# EAGLE design amc6821-breakout-v3.0 (EAGLE 9.6.2)
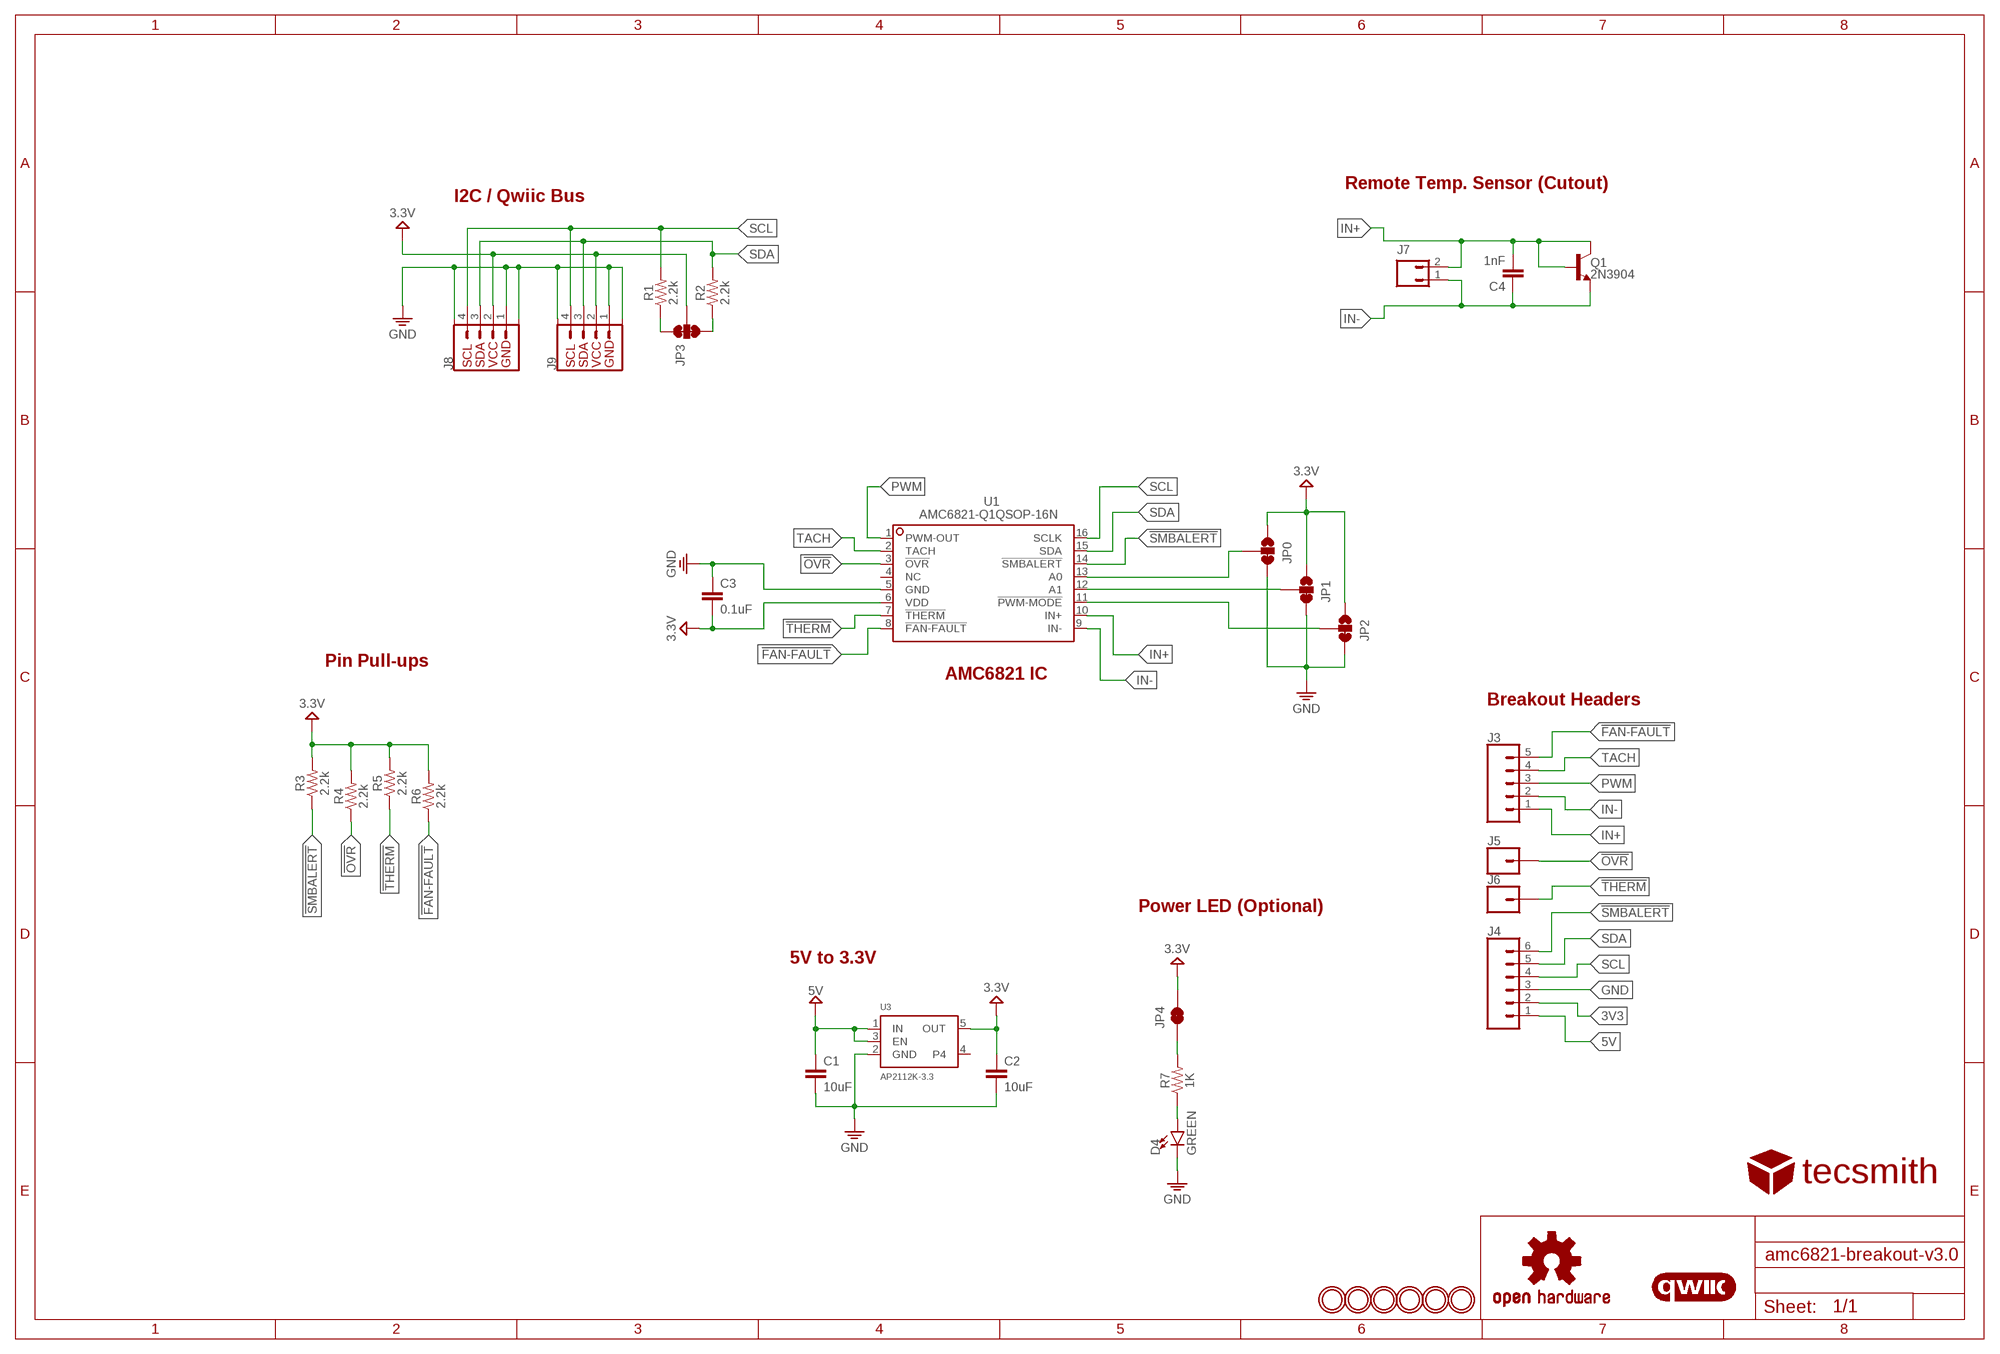
[diagram p0: schematic, sheet 1]

## Parts
C1  10uF  10UF-0603-6.3V-20%  [0603]
C2  10uF  10UF-0603-6.3V-20%  [0603]
C3  0.1uF  0.1UF-0603-25V-5%  [0603]
C4  1nF  1.0NF/1000PF-0603-50V-10%  [0603]
D4  GREEN  LED-GREEN0603  [LED-0603]
J3  CONN_05  [1X05]
J4  CONN_06SILK_FEMALE_PTH  [1X06]
J5  CONN_01  [1X01]
J6  CONN_01  [1X01]
J7  CONN_02  [1X02-LONG]
J8  QWIIC_RIGHT_ANGLE  QWIIC_CONNECTOR_GNDJS-1MM  [JST04_1MM_RA]
J9  QWIIC_RIGHT_ANGLE  QWIIC_CONNECTOR_GNDJS-1MM  [JST04_1MM_RA]
JP0  JUMPER-SMT_3_1-NC_TRACE_SILK  [SMT-JUMPER_3_1-NC_TRACE_SILK]
JP1  JUMPER-SMT_3_1-NC_TRACE_SILK  [SMT-JUMPER_3_1-NC_TRACE_SILK]
JP2  JUMPER-SMT_3_1-NC_TRACE_SILK  [SMT-JUMPER_3_1-NC_TRACE_SILK]
JP3  JUMPER-SMT_3_2-NC_TRACE_SILK  [SMT-JUMPER_3_2-NC_TRACE_SILK]
JP4  JUMPER-SMT_2_NC_TRACE_SILK  [SMT-JUMPER_2_NC_TRACE_SILK]
LOGO1  OSHW-LOGOS  [OSHW-LOGO-S]
LOGO2  QWIIC_LOGO_6MM  [QWIIC_6MM]
Q1  2N3904  TRANS_NPN-MMBTA42  [SOT23-3]
R1  2.2k  2.2KOHM-0603-1/10W-1%  [0603]
R2  2.2k  2.2KOHM-0603-1/10W-1%  [0603]
R3  2.2k  2.2KOHM-0603-1/10W-1%  [0603]
R4  2.2k  2.2KOHM-0603-1/10W-1%  [0603]
R5  2.2k  2.2KOHM-0603-1/10W-1%  [0603]
R6  2.2k  2.2KOHM-0603-1/10W-1%  [0603]
R7  1K  RESISTOR0805  [0805]
U1  AMC6821-Q1QSOP-16N  [QSOP-16N]
U3  AP2112K-3.3  VREG_SOT23-5  [SOT23-5]
U$1  TECSMITH-LOGO  [TECSMITH-LOGO]
U$4  MOUNTINGHOLE2.5  [MOUNTINGHOLE_2.5_PLATED]
U$5  MOUNTINGHOLE2.5  [MOUNTINGHOLE_2.5_PLATED]
U$7  MOUNTINGHOLE2.5  [MOUNTINGHOLE_2.5_PLATED]
U$8  MOUNTINGHOLE2.5  [MOUNTINGHOLE_2.5_PLATED]
U$9  MOUNTINGHOLE2.5  [MOUNTINGHOLE_2.5_PLATED]
U$10  MOUNTINGHOLE2.5  [MOUNTINGHOLE_2.5_PLATED]

## Nets
3V3: C2.1 C3.2 J4.2 J8.2 J9.2 JP0.1 JP1.1 JP2.1 JP3.2 JP4.2 R3.2 R4.2 R5.2 R6.2 U1.6(VDD) U3.5(OUT) ; supply symbol labelled 3.3V
5V: C1.1 J4.1 U3.1(IN) U3.3(EN)
!FAN-FAULT: J3.5 R6.1 U1.8(!FAN-FAULT)
!OVR: J5.1 R4.1 U1.3(!OVR)
!SMBALERT: J4.6 R3.1 U1.14(!SMBALERT)
!THERM: J6.1 R5.1 U1.7(!THERM)
GND: C1.2 C2.2 C3.1 D4.C J4.3 J8.1 J8.NC1 J8.NC2 J9.1 J9.NC1 J9.NC2 JP0.3 JP1.3 JP2.3 U1.5(GND) U3.2(GND)
IN+: C4.2 J3.1 J7.2 Q1.1(B) Q1.3(C) U1.10(IN+)
IN-: C4.1 J3.2 J7.1 Q1.2(E) U1.9(IN-)
N$1: JP0.2 U1.13(A0)
N$3: JP3.3 R2.1
N$4: JP3.1 R1.1
N$5: JP2.2 U1.11(!PWM-MODE)
N$6: JP1.2 U1.12(A1)
N$8: D4.A R7.1
N$12: JP4.1 R7.2
PWM: J3.3 U1.1(PWM-OUT)
SCL: J4.4 J8.4 J9.4 R1.2 U1.16(SCLK)
SDA: J4.5 J8.3 J9.3 R2.2 U1.15(SDA)
TACH: J3.4 U1.2(TACH)
Unconnected: U1.4(NC) U3.4

## Notes on the sheet
- Remote Temp. Sensor (Cutout)
- I2C / Qwiic Bus
- Pin Pull-ups
- AMC6821 IC
- Breakout Headers
- Power LED (Optional)
- 5V to 3.3V

## Library data of the parts
C1 C2 = SparkFun-Capacitors:10UF: 10.0µF ceramic capacitors A capacitor is a passive two-terminal electrical component used to store electrical energy temporarily in an electric field.; PROD_ID: CAP-11015
C3 = SparkFun-Capacitors:0.1UF: 0.1µF ceramic capacitors A capacitor is a passive two-terminal electrical component used to store electrical energy temporarily in an electric field.; PROD_ID: CAP-08604
C4 = SparkFun-Capacitors:1.0NF/1000PF: 1nF/1,000pF ceramic capacitors A capacitor is a passive two-terminal electrical component used to store electrical energy temporarily in an electric field.; PROD_ID: CAP-07886
D4 = SparkFun-LED:LED-GREEN: Green SMD LED Used in manufacturing of various products at SparkFun Packages: 0603 - SMD 0603 package [Product Link] <http://www.futureelectronics.com/en/technologies/semiconductors/optoelectronics/leds/Pages/9894312-LTST-C190GKT.aspx?CrossPart=HSMG-C190&IM=0> LilyPad 1206 - SMD1206 LilyPad package [Product Link] <http://www.futureelectronics.com/en/Technologies/Product.aspx?ProductID=IN150NGHARVATEKCORPORATION2049943&IM=0> 1206 - SMD1206 package [Product Link] <http://www.futureelectronics.com/en/technologies/semiconductors/optoelectronics/leds/Pages/8315665-LTST-C150KGKT.aspx?IM=0> 1206 Bottom Mount -SMD 1206 Bottom Mount [Product Link] <http://www.digikey.com/product-detail/en/lite-on-inc/LTST-C230KGKT/160-1456-1-ND/386854> SparkFun Products: Pro Mini 328 -5V <https://www.sparkfun.com/products/821> RedBoard <https://www.sparkfun.com/products/12757> MP3 Trigger <https://www.sparkfun.com/products/13720> Makey Makey <https://www.sparkfun.com/products/11076>; PROD_ID: DIO-00821
J3 = SparkFun-Connectors:CONN_05: Multi connection point. Often used as Generic Header-pin footprint for 0.1 inch spaced/style header connections On any of the 0.1 inch spaced packages, you can populate with these: Break Away Headers - Straight <https://www.sparkfun.com/products/116> (PRT-00116) Break Away Male Headers - Right Angle <https://www.sparkfun.com/products/553> (PRT-00553) Female Headers <https://www.sparkfun.com/products/115> (PRT-00115) Break Away Headers - Machine Pin <https://www.sparkfun.com/products/117> (PRT-00117) Break Away Female Headers - Swiss Machine Pin <https://www.sparkfun.com/products/743> (PRT-00743) For SCREWTERMINALS and SPRING TERMINALS visit here: Screw Terimnals on SparkFun.com <https://www.sparkfun.com/search/results?term=Screw+Terminals> (5mm/3.5mm/2.54mm spacing) This device is also useful as a general connection point to wire up your design to another part of your project. Our various solder wires solder well into these plated through hole pads. Hook-Up Wire - Assortment (Stranded, 22 AWG) <https://www.sparkfun.com/products/11375> (PRT-11375) Hook-Up Wire - Assortment (Solid Core, 22 AWG) <https://www.sparkfun.com/products/11367> (PRT-11367) View the entire wire category on our website here <https://www.sparkfun.com/categories/141> Special notes: Molex polarized connector foot print use with SKU : PRT-08231 with associated crimp pins and housings. 1MM SMD Version SKU: PRT-10208
J4 = SparkFun-Connectors:CONN_06: Multi connection point. Often used as Generic Header-pin footprint for 0.1 inch spaced/style header connections On any of the 0.1 inch spaced packages, you can populate with these: Break Away Headers - Straight <https://www.sparkfun.com/products/116> (PRT-00116) Break Away Male Headers - Right Angle <https://www.sparkfun.com/products/553> (PRT-00553) Female Headers <https://www.sparkfun.com/products/115> (PRT-00115) Break Away Headers - Machine Pin <https://www.sparkfun.com/products/117> (PRT-00117) Break Away Female Headers - Swiss Machine Pin <https://www.sparkfun.com/products/743> (PRT-00743) Arduino Stackable Header - 6 Pin <https://www.sparkfun.com/products/9280> (PRT-09280) For SCREWTERMINALS and SPRING TERMINALS visit here: Screw Terimnals on SparkFun.com <https://www.sparkfun.com/search/results?term=Screw+Terminals> (5mm/3.5mm/2.54mm spacing) This device is also useful as a general connection point to wire up your design to another part of your project. Our various solder wires solder well into these plated through hole pads. Hook-Up Wire - Assortment (Stranded, 22 AWG) <https://www.sparkfun.com/products/11375> (PRT-11375) Hook-Up Wire - Assortment (Solid Core, 22 AWG) <https://www.sparkfun.com/products/11367> (PRT-11367) View the entire wire category on our website here <https://www.sparkfun.com/categories/141>; PROD_ID: CONN-08437
J5 J6 = SparkFun-Connectors:CONN_01: Single connection point. Often used as Generic Header-pin footprint for 0.1 inch spaced/style header connections On any of the 0.1 inch spaced packages, you can populate with these: Break Away Headers - Straight <https://www.sparkfun.com/products/116> (PRT-00116) Break Away Male Headers - Right Angle <https://www.sparkfun.com/products/553> (PRT-00553) Female Headers <https://www.sparkfun.com/products/115> (PRT-00115) Break Away Headers - Machine Pin <https://www.sparkfun.com/products/117> (PRT-00117) Break Away Female Headers - Swiss Machine Pin <https://www.sparkfun.com/products/743> (PRT-00743) This device is also useful as a general connection point to wire up your design to another part of your project. Our various solder wires solder well into these plated through hole pads. Hook-Up Wire - Assortment (Stranded, 22 AWG) <https://www.sparkfun.com/products/11375> (PRT-11375) Hook-Up Wire - Assortment (Solid Core, 22 AWG) <https://www.sparkfun.com/products/11367> (PRT-11367) View the entire wire category on our website here <https://www.sparkfun.com/categories/141> Special notes: SMTSO-256-ET is a "flush mount" nut for a 4-40 screw. We mostly use this on specialty testbeds; it is a nice way to connect hardware to your PCB at an adjustable hieght. Also note, the SNAP packages are for using a snappable style connector. We sell a baggie of snaps and they are also used on two LilyPad designs: Snap Assortment - 30 pack (male and female) <https://www.sparkfun.com/products/11347> (DEV-11347) LilyPad Arduino SimpleSnap <https://www.sparkfun.com/products/10941> (DEV-10941) LilyPad SimpleSnap Protoboard <https://www.sparkfun.com/products/10940> (DEV-10940)
J7 = VinoRodrigues_Custom_Eagle:CONN_02: Multi connection point. Often used as Generic Header-pin footprint for 0.1 inch spaced/style header connections On any of the 0.1 inch spaced packages, you can populate with these: Break Away Headers - Straight <https://www.sparkfun.com/products/116> (PRT-00116) Break Away Male Headers - Right Angle <https://www.sparkfun.com/products/553> (PRT-00553) Female Headers <https://www.sparkfun.com/products/115> (PRT-00115) Break Away Headers - Machine Pin <https://www.sparkfun.com/products/117> (PRT-00117) Break Away Female Headers - Swiss Machine Pin <https://www.sparkfun.com/products/743> (PRT-00743) For SCREWTERMINALS and SPRING TERMINALS visit here: Screw Terimnals on SparkFun.com <https://www.sparkfun.com/search/results?term=Screw+Terminals> (5mm/3.5mm/2.54mm spacing) This device is also useful as a general connection point to wire up your design to another part of your project. Our various solder wires solder well into these plated through hole pads. Hook-Up Wire - Assortment (Stranded, 22 AWG) <https://www.sparkfun.com/products/11375> (PRT-11375) Hook-Up Wire - Assortment (Solid Core, 22 AWG) <https://www.sparkfun.com/products/11367> (PRT-11367) View the entire wire category on our website here <https://www.sparkfun.com/categories/141> Special notes: Molex polarized connector foot print use with: PRT-08233 with associated crimp pins and housings. 2.54_SCREWTERM for use with PRT-10571. 3.5mm Screw Terminal footprints for PRT-08084 5mm Screw Terminal footprints for use with PRT-08432
J8 J9 = VinoRodrigues_Custom_Eagle:QWIIC_CONNECTOR_GND: SparkFun I2C Standard Qwiic Connector An SMD 1mm pitch JST connector makes it easy and quick (get it? Qwiic?) to connect I2C devices to each other. The Qwiic system <http://www.sparkfun.com/qwiic> enables fast and solderless connection between popular platforms and various sensors and actuators. We carry 200mm <https://www.sparkfun.com/products/14204>, 100mm <https://www.sparkfun.com/products/14205>, 50mm <https://www.sparkfun.com/products/14206>, and breadboard friendly <https://www.sparkfun.com/products/14207> Qwiic cables. We also offer 10 pcs strips <https://www.sparkfun.com/products/14323> the SMD connectors.; PROD_ID: CONN-13694
JP0 JP1 JP2 = SparkFun-Jumpers:JUMPER-SMT_3_1-NC_TRACE: Normally closed trace jumper (1 of 2 connections) This jumper has a trace between two pads so it's normally closed (NC). The other connection is normally open (NO). Use a razor knife to open the connection. For best results follow the IPC guidelines for cutting traces: Cutout at least 0.063 mm (0.005 in). Remove all loose material to clean up the cut area. Seal the cut with an approved epoxy. Reapply solder to reclose the connection, or to close the NO connection.
JP3 = SparkFun-Jumpers:JUMPER-SMT_3_2-NC_TRACE: Normally closed trace jumper (2 of 2 connections) This jumper has a trace between all three pads so they are normally closed (NC). Use a razor knife to open the connection(s). For best results follow the IPC guidelines for cutting traces: Cutout at least 0.063 mm (0.005 in). Remove all loose material to clean up the cut area. Seal the cut with an approved epoxy. Reapply solder to reclose the connection(s).
JP4 = SparkFun-Jumpers:JUMPER-SMT_2_NC_TRACE: Normally closed trace jumper This jumper has a trace between two pads so it's normally closed (NC). Use a razor knife to open the connection. For best results follow the IPC guidelines for cutting traces: Cutout at least 0.063 mm (0.005 in). Remove all loose material to clean up the cut area. Seal the cut with an approved epoxy. Reapply solder to reclose the connection.
LOGO1 = SparkFun-Aesthetics:OSHW-LOGO: Open-Source Hardware (OSHW) Logo This logo indicates the piece of hardware it is found on incorporates a OSHW license and/or adheres to the definition of open source hardware found here: http://freedomdefined.org/OSHW
LOGO2 = SparkFun-Aesthetics:QWIIC_LOGO: Qwiic Logos for placement on schematic and PCB. The 5.5mm silk logo is best for placing next to Qwiic connector.
Q1 = SparkFun-DiscreteSemi:TRANS_NPN: NPN transistor Current controlled devices typically used to amplify current or used as a switch. BC547 - COM-08928 <http://www.sparkfun.com/products/8928> (TO-92 45V 100mA) (1.Collector 2.Base 3.Emitter) 2N3904 - COM-00521 <http://www.sparkfun.com/products/521> (TO-92 40V 200mA) (1.Emitter 2.Base 3.Collector) P2N2222A - COM-12852 <http://www.sparkfun.com/products/12852> (TO-92 40V 600mA) (1.Collector 2.Base 3.Emitter); PROD_ID: TRANS-09116; VALUE: 500mA/300V
R1-R6 = SparkFun-Resistors:2.2KOHM: 2.2kΩ resistor A resistor is a passive two-terminal electrical component that implements electrical resistance as a circuit element. Resistors act to reduce current flow, and, at the same time, act to lower voltage levels within circuits. - Wikipedia; PROD_ID: RES-08272
R7 = SparkFun-Resistors:RESISTOR: Generic Resistor Package
U1 = VinoRodrigues_Custom_Eagle:AMC6821-Q1: AMC6821 www.ti.com/product/AMC6821
U3 = microbuilder:VREG_SOT23-5: SOT23-5 Fixed Voltage Regulators Part Current Out V Out V In V Dropout θJA (°C/W) TJ (°C) Digikey Part No. ADP121 150mA 3.3V 3.4-5.5V 0.09V @ 150mA -- -- ADP121-AUJZ33R7CT-ND ADP121 150mA 3.0V 3.1-5.5V 0.09V @ 150mA -- -- ADP121-AUJZ30R7CT-ND ADP122 300mA 3.3V 3.4-5.5V 0.085V @ 300mA -- -- ADP122AUJZ-3.3-R7CT-ND ADP1712 300mA 3.3V 3.5-5.5V 0.17V @ 300mA -- -- ADP1712AUJZ-3.3-R7TR-ND AP7311 (Low Cost) 150mA 3.3V 3.5-6V 0.15V @ 150mA -- -- AP7311-33WG-7DICT-ND LD39015M18R 150mA 1.8V 1.9V-5.5V 0.08V @ 100mA -- -- 497-6977-1-ND LP2985A-33DBVR 150mA 3.3V 3.3-16V 0.28V @ 150mA 206 150 296-18479-1-ND MCP1824T-3302E/OT 300mA 3.3V 3.5V-6V 0.2V @ 300mA -- -- MCP1824T-3302E/OTCT-ND MIC5205-2.5YM5 TR 150mA 2.5V 2.7-16V 0.165V @ 150mA -- -- 576-1257-2-ND MIC5205-3.0YM5 TR 150mA 3.0V 3.2V-16V 0.165V @ 150mA -- -- 576-1258-2-ND MIC5205-3.3YM5 TR 150mA 3.3V 3.5V-16V 0.165V @ 150mA -- -- 576-1259-2-ND TPS780330220 150mA 3.3V+2.2V 3.6-5.5V 250mV Max -- -- 296-23332-1-ND TDA3663/N1,135 100mA 3.3V 3.5-45V 0.18V @ 50mA -- -- 568-5343-1-ND Max operating temp can be calculated using θJA, TJ (max junction temperature), and power in watts. Set the "Maximum Ambient Temperature" until it reaches TJ ("Max Junction Temperature"), which is the absolute limit for safe use of the regulator: Heat Sink Temperature Calculator <http://www.daycounter.com/Calculators/Heat-Sink-Temperature-Calculator.phtml> For example, With 12V source into a 3.3V LP2985 and a 30mA load, we are dissipating (12V-3.3V) * 0.03A = 0.261W. With a θJA of 206 °C/W, a TJ of 150°C, and 261mW we can safely use the chip without a heat sink up to 75°C (=147.1°C Junction Temperature).
U$1 = VinoRodrigues_Custom_Eagle:TECSMITH-LOGO
U$4 U$5 U$7-U$10 = microbuilder:MOUNTINGHOLE: Mounting Hole For #2 screws (0.086"/2.18mm width, 0.094"/2.4mm hole) use 2.5mm; BOM: EXCLUDE

## Net classes
1 highpower: width 0.305 mm, drill 0.483 mm
2 lowpower: width 0.254 mm, drill 0.483 mm

## Board
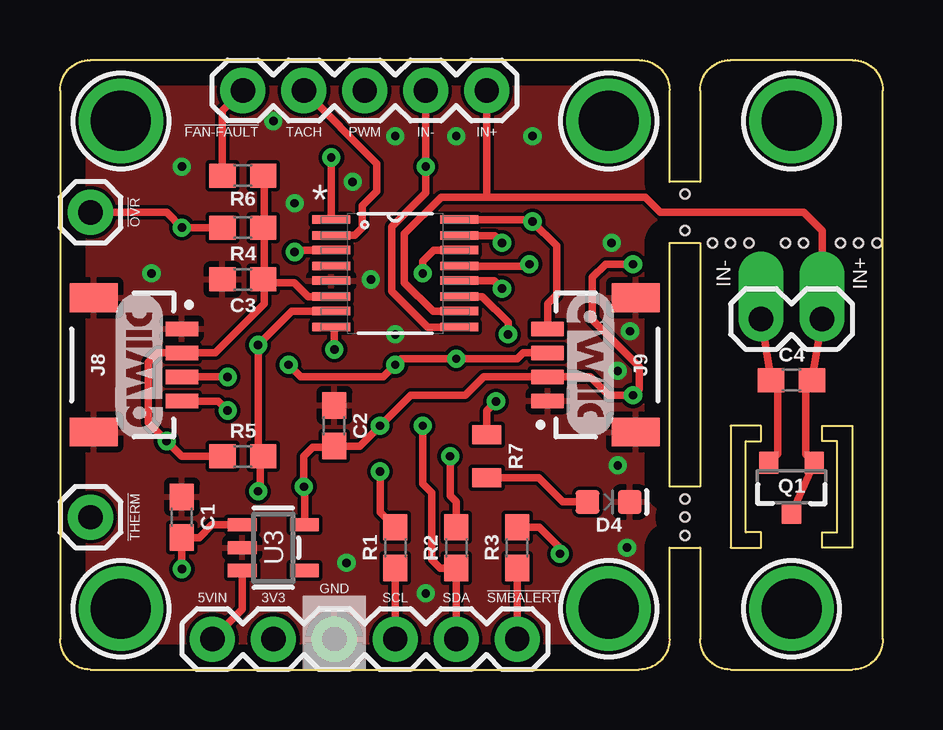
[diagram p1: board, top side]
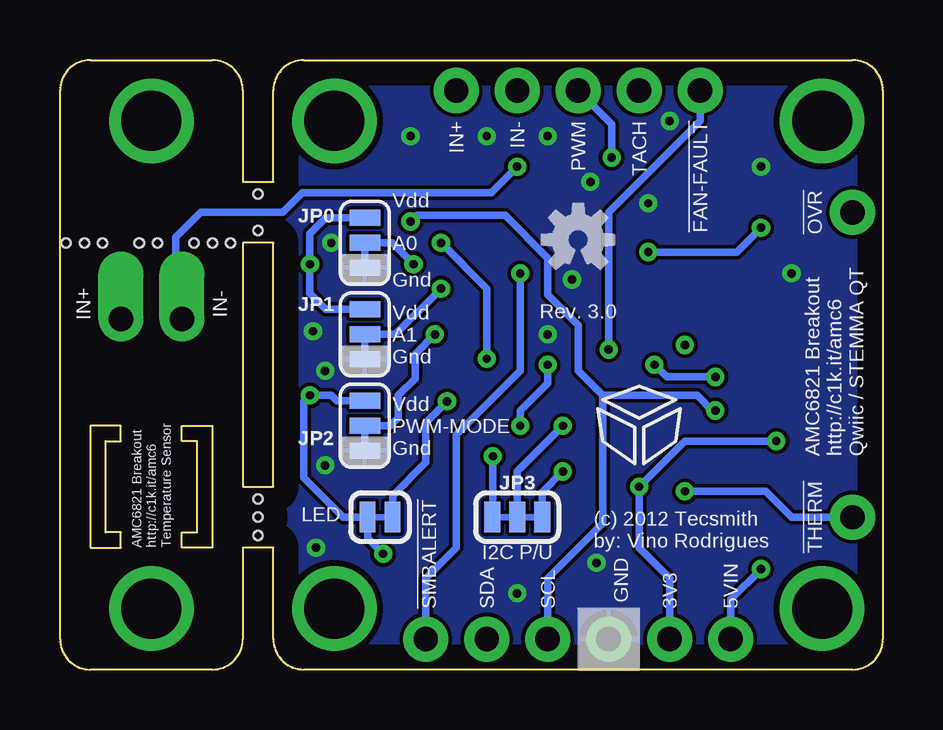
[diagram p2: board, bottom side, seen from below]

Size 34.29 x 25.4 mm. Coordinates in mm from the lower left corner, seen from the top.
Outline: 1.27,0 24.13,0 arc90 25.4,1.27 25.4,5.08 26.67,5.08 26.67,1.27 arc90 27.94,0 33.02,0 arc90 34.29,1.27 34.29,24.13 arc90 33.02,25.4 27.94,25.4 arc90 26.67,24.13 26.67,20.32 25.4,20.32 25.4,24.13 arc90 24.13,25.4 1.27,25.4 arc90 0,24.13 0,1.27 arc90 1.27,0
Outline: 25.4,17.78 26.67,17.78 26.67,7.62 25.4,7.62 25.4,17.78
Outline: 27.94,10.16 27.94,5.08 29.21,5.08 29.21,5.71 28.57,5.71 28.57,9.53 29.21,9.53 29.21,10.16 27.94,10.16
Outline: 33.02,10.16 33.02,5.08 31.75,5.08 31.75,5.71 32.38,5.71 32.38,9.53 31.75,9.53 31.75,10.16 33.02,10.16
Copper layers (1*16): Top 0.035mm / dielectric 1.5mm / Bottom 0.035mm
Design rules "default": minimum track width 6mil, minimum drill 0.35mm, track to track 6mil, track to pad 6mil, pad to pad 6mil, via to via 6mil, smd to smd 6mil, copper to edge 40mil, drill to drill 6mil, minimum pad ring 10mil, minimum via ring 8mil, stop-mask expansion 4mil, vias tented up to drill 0mil, thermal gap 10mil
Holes 0.38 mm at 26.04,19.81 26.04,18.29 26.04,6.35 26.04,7.11 26.04,5.59 27.94,17.78 30.23,17.78 30.99,17.78 27.18,17.78 28.7,17.78 32.51,17.78 33.27,17.78 34.04,17.78

### Footprints (pad centres in the part's own frame; a part is rotated, then mirrored left to right if it is on the bottom)
0603 = smd 1.1 x 1: 1 -0.85,0; 2 0.85,0
LED-0603 = smd 1 x 1: A -0.877,0; C 0.877,0
1X05 = drill 1.016 pad 1.88: 1 0,0; 2 2.54,0; 3 5.08,0; 4 7.62,0; 5 10.16,0
1X06 = drill 1.016 pad 1.88: 1 0,0; 2 2.54,0; 3 5.08,0; 4 7.62,0; 5 10.16,0; 6 12.7,0
1X01 = drill 1.016 pad 1.88: 1 0,0
1X02-LONG = drill 1.016 pad 1.88 offset: 1 0,0; 2 2.54,0
JST04_1MM_RA = smd 0.6 x 1.35: 1 -1.5,0; 2 -0.5,0; 3 0.5,0; 4 1.5,0 | smd 1.2 x 2: NC1 2.8,-3.675; NC2 -2.8,-3.675
SMT-JUMPER_3_1-NC_TRACE_SILK = smd 0.66 x 1.27: 1 -1.041,0; 2 0,0; 3 1.041,0
SMT-JUMPER_3_2-NC_TRACE_SILK = smd 0.66 x 1.27: 1 -1.041,0; 2 0,0; 3 1.041,0
SMT-JUMPER_2_NC_TRACE_SILK = smd 0.66 x 1.27: 1 -0.521,0; 2 0.521,0
SOT23-3 = smd 0.8 x 0.9: 1 -0.95,-1; 2 0.95,-1; 3 0,1.1
0805 = smd 0.8 x 1.2: 1 -0.9,0; 2 0.9,0
QSOP-16N = smd 1.6 x 0.356: 1 -2.667,2.235; 2 -2.667,1.575; 3 -2.667,0.965; 4 -2.667,0.305; 5 -2.667,-0.305; 6 -2.667,-0.965; 7 -2.667,-1.575; 8 -2.667,-2.235; 9 2.667,-2.235; 10 2.667,-1.575; 11 2.667,-0.965; 12 2.667,-0.305; 13 2.667,0.305; 14 2.667,0.965; 15 2.667,1.575; 16 2.667,2.235
SOT23-5 = smd 0.55 x 1.2: 1 -0.95,-1.3; 2 0,-1.3; 3 0.95,-1.3; 4 0.95,1.3; 5 -0.95,1.3
MOUNTINGHOLE_2.5_PLATED = drill 2.5 pad 3.2: P$1 0,0

### Placement (x,y rotation side)
C1  5.08,6.35 90 top
C2  11.43,10.16 90 top
C3  7.62,16.26 0 top
C4  30.48,12.06 0 top
D4  22.86,6.99 0 top
J3  17.78,24.13 180 top
J4  6.35,1.27 0 top
J5  1.27,19.05 0 top
J6  1.27,6.35 0 top
J7  29.21,14.61 0 top
J8  5.08,12.7 270 top
J9  20.32,12.7 90 top
JP0  21.59,17.78 270 bottom
JP1  21.59,13.97 270 bottom
JP2  21.59,10.16 270 bottom
JP3  15.24,6.35 180 bottom
JP4  20.95,6.35 180 bottom
LOGO1  12.7,17.91 0 bottom
LOGO2  3.3,12.7 90 top
LOGO3  QWIIC_LOGO_6MM  [QWIIC_6MM]  22.1,12.7 270 top
Q1  MMBT3904 SOT-23  [SOT23-3]  30.48,7.62 180 top
R1  13.97,5.08 270 top
R2  16.51,5.08 270 top
R3  19.05,5.08 90 top
R4  7.62,18.41 0 top
R5  7.62,8.89 180 top
R6  7.62,20.57 0 top
R7  17.78,8.89 90 top
U1  13.97,16.51 0 top
U3  8.89,5.08 270 top
U$1  10.16,10.29 0 bottom
U$4  2.54,2.54 0 top
U$5  2.54,22.86 0 top
U$7  22.86,2.54 0 top
U$8  22.86,22.86 0 top
U$9  30.48,2.54 0 top
U$10  30.48,22.86 0 top

### Tracks (layer width: path | path; a pad name or v marks a point on that pad's centre or on a via)
3V3  (via drill 0.35)
  Top 0.305: 10.32,6.03 U3.5 10.19,7.59 v10.16,7.62 10.16,8.89 10.54,9.27 11.39,9.27 C2.1 | C2.1 11.26,9.31 | C2.1 11.47,9.27 | 8.51,18.45 R4.2 8.51,18.38 | U1.6 10.34,15.54 9.75,16.13 8.51,16.13 | C2.1 12.48,9.31 v13.34,10.16 14.61,11.43 16.89,11.43 17.66,12.2 J9.2 22.09,12.2 22.86,11.43 v23.88,11.43 24.13,11.68 24.13,12.62 22.18,14.57 22.18,16.34 22.73,16.89 v23.88,16.89 | R3.2 19.98,5.93 20.83,5.08 v20.83,4.83 | C3.2 8.51,16.3 | 8.51,16.13 8.51,16.3 | 8.51,16.3 8.51,18.38 | R6.2 8.51,20.54 8.51,18.38 | R5.2 5.08,8.89 v4.45,9.53 3.68,10.29 3.68,12.81 4.07,13.2 J8.2 6.47,13.2 8.51,15.24 8.51,16.13
  Bottom 0.305: J4.2 8.89,3.81 10.16,5.08 v10.16,7.62 8.26,9.53 v4.45,9.53 | v13.34,10.16 15.24,8.26 JP3.2 | v20.83,4.83 21.48,5.47 JP4.2 22.48,6.35 24.13,8 24.13,11.18 v23.88,11.43 22.99,11.43 22.76,11.2 JP2.1 | JP0.1 23.22,18.82 23.88,18.16 v23.88,16.89 23.88,15.67 23.22,15.01 JP1.1
5V  (via drill 0.35)
  Top 0.305: U3.1 6.33,6.03 5.8,5.5 C1.1 v5.08,4.19 | U3.3 7.59,2.51 J4.1
  Bottom 0.305: v5.08,4.19 6.35,2.92 J4.1
!FAN-FAULT  (via drill 0.35)
  Top 0.305: R6.1 6.77,23.28 J3.5 | v11.43,13.34 11.43,14.15 U1.8
  Bottom 0.305: J3.5 7.62,22.86 11.43,19.05 v11.43,13.34
!OVR  (via drill 0.35)
  Top 0.305: v9.78,17.4 9.86,17.48 U1.3 | J5.1 4.45,19.05 v5.08,18.41 R4.1
  Bottom 0.305: v5.08,18.41 6.1,17.4 v9.78,17.4
!SMBALERT  (via drill 0.35)
  Top 0.305: U1.14 15.57,17.48 15.11,17.02 v15.11,16.51 | J4.6 R3.1
  Bottom 0.305: J4.6 19.05,3.81 17.78,5.08 17.78,9.78 15.11,12.45 v15.11,16.51
!THERM  (via drill 0.35)
  Top 0.305: U1.7 9.66,14.94 v8.26,13.53 8.26,9.11 R5.1 8.34,8.76 8.34,7.52 v8.26,7.43
  Bottom 0.305: 8.26,13.57 v8.26,13.53 | v8.26,7.43 4.89,7.43 3.81,6.35 J6.1
GND  (via drill 0.35)
  other vias: 23.24,12.45 13.97,22.23 16.51,22.23 5.08,20.95 8.89,22.86 9.78,19.43 12.95,16.26 12.19,20.32 15.24,3.17 23.24,8.51 19.68,22.23 3.81,16.51 11.94,4.45 13.97,13.97 23.62,5.08 22.99,17.78 23.75,14.1
  pour Bottom: 0,0 0,25.4 25.4,25.4 25.4,0
  pour Top: 0,0 0,25.4 25.4,25.4 25.4,0
IN+
  Top 0.305: U1.10 15.54,14.94 14.35,16.13 14.35,18.16 15.88,19.68 17.78,19.68 | 17.78,19.68 24.38,19.68 25.02,19.05 30.99,19.05 31.75,18.29 J7.2 C4.2 31.08,11.81 31.08,8.97 Q1.1 Q1.3 | J3.1 17.78,19.68
IN-  (via drill 0.35)
  Top 0.305: U1.9 15.32,14.28 13.82,15.77 13.82,18.46 15.24,19.88 v15.24,20.95 J3.2 | Q1.2 29.91,9 29.91,11.78 C4.1 J7.1
  Bottom 0.305: J7.1 29.46,14.86 29.46,18.01 28.42,19.05 25.02,19.05 24.19,19.88 16.32,19.88 v15.24,20.95
N$1  (via drill 0.35)
  Top 0.305: v19.56,16.89 19.48,16.82 U1.13
  Bottom 0.305: JP0.2 20.45,17.78 v19.56,16.89
N$3  (via drill 0.35)
  Top 0.305: v16.26,8.89 16.26,7.24 16.51,6.99 R2.1
  Bottom 0.305: v16.26,8.89 16.26,6.38 JP3.3
N$4  (via drill 0.35)
  Top 0.305: R1.1 13.34,6.57 v13.34,8.26
  Bottom 0.305: 14.22,6.33 JP3.1 14.2,7.39 v13.34,8.26
N$5  (via drill 0.35)
  Top 0.305: v18.67,13.97 18.67,14.48 17.6,15.54 U1.11
  Bottom 0.305: JP2.2 20.52,10.16 20.19,10.49 20.19,11.43 19.49,12.13 19.49,13.14 v18.67,13.97
N$6  (via drill 0.35)
  Top 0.305: U1.12 18.09,16.2 v18.41,15.88
  Bottom 0.305: JP1.2 20.3,13.97 20.3,13.99 v18.41,15.88
N$8
  Top 0.305: R7.1 19.95,7.99 20.95,6.99 D4.A
N$12  (via drill 0.35)
  Top 0.305: v18.16,11.18 17.78,10.79 R7.2
  Bottom 0.305: JP4.1 20.43,7.25 19.05,8.64 19.05,10.29 v18.16,11.18
PWM  (via drill 0.35)
  Top 0.305: v11.3,21.34 U1.1
  Bottom 0.305: v11.3,21.34 11.3,22.73 J3.3
SCL  (via drill 0.35)
  Top 0.305: v6.99,10.79 6.6,11.18 5.1,11.18 J8.4 | U1.16 19.61,18.75 v19.68,18.67 20.7,17.65 20.7,15.62 20.32,15.24 J9.4 | J4.4 R1.2
  Bottom 0.305: J4.4 13.97,3.81 11.68,6.1 11.68,11.43 | v19.68,18.67 19.43,18.92 15.75,18.92 13.97,17.14 13.97,15.62 12.7,14.35 12.7,12.45 11.68,11.43 | 11.68,11.43 7.75,11.43 7.11,10.79 v6.99,10.79
SDA  (via drill 0.35)
  Top 0.305: J9.3 19.3,13.2 19.06,12.95 v16.51,12.95 14.22,12.95 v13.97,12.7 13.46,12.19 10.03,12.19 v9.53,12.7 | J8.3 v6.99,12.19 | U1.15 18.11,18.09 v18.41,17.78 | J4.5 R2.2 15.84,4.23 15.49,4.57 15.49,7.37 15.11,7.75 v15.11,10.16
  Bottom 0.305: v9.53,12.7 9.02,12.19 v6.99,12.19 | v16.51,12.95 16.51,15.88 v18.41,17.78 | v15.11,10.16 15.11,10.79 13.97,11.94 v13.97,12.7
TACH
  Top 0.305: U1.2 11.32,18.1 12.28,18.1 12.59,18.4 12.59,19.32 13.21,19.94 13.21,21.08 J3.4

### Text on the board
tNames: !FAN-FAULT | TACH | PWM | IN- | IN+ | !OVR | IN- | IN+ | !THERM | 5VIN | 3V3 | GND | SCL | SDA | !SMBALERT
bNames: !FAN-FAULT | TACH | PWM | IN- | IN+ | Vdd | !OVR | A0 | Gnd | Rev. 3.0 | IN- | IN+ | Vdd / A1 / Gnd | Vdd / PWM-MODE / Gnd | AMC6821 Breakout / http://c1k.it/amc6 / Qwiic / STEMMA QT | !THERM | (c) 2012 Tecsmith / by: Vino Rodrigues | LED | I2C P/U | AMC6821 Breakout / http://c1k.it/amc6 / Temperature Sensor | 5VIN | 3V3 | GND | SCL | SDA | !SMBALERT